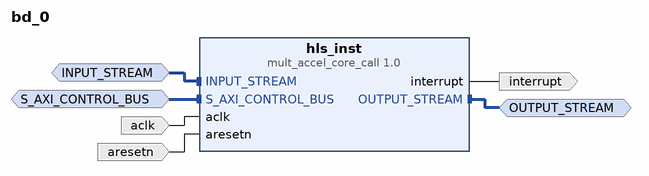
[diagram p0: block diagram of the top level]
# Vivado block design bd_0, xc7z007sclg225-1, Vivado 2018.3
create_bd_design bd_0

create_bd_intf_port -mode Slave -vlnv xilinx.com:interface:axis_rtl:1.0 INPUT_STREAM
set_property -dict [list \
  CONFIG.FREQ_HZ 100000000.0 \
  CONFIG.HAS_TKEEP 1 \
  CONFIG.HAS_TLAST 1 \
  CONFIG.HAS_TREADY 1 \
  CONFIG.HAS_TSTRB 1 \
  CONFIG.LAYERED_METADATA {xilinx.com:interface:datatypes:1.0 {TDATA {datatype {name {attribs {resolve_type immediate dependency {} format string minimum {} maximum {}} value {}} bitwidth {attribs {resolve_type immediate dependency {} format long minimum {} maximum {}} value 32} bitoffset {attribs {resolve_type immediate dependency {} format long minimum {} maximum {}} value 0} integer {signed {attribs {resolve_type immediate dependency {} format bool minimum {} maximum {}} value false}}}} TUSER {datatype {name {attribs {resolve_type immediate dependency {} format string minimum {} maximum {}} value {}} bitwidth {attribs {resolve_type immediate dependency {} format long minimum {} maximum {}} value 4} bitoffset {attribs {resolve_type immediate dependency {} format long minimum {} maximum {}} value 0} integer {signed {attribs {resolve_type immediate dependency {} format bool minimum {} maximum {}} value false}}}}}} \
  CONFIG.TDATA_NUM_BYTES 4 \
  CONFIG.TDEST_WIDTH 5 \
  CONFIG.TID_WIDTH 5 \
  CONFIG.TUSER_WIDTH 4 \
] [get_bd_intf_ports INPUT_STREAM]
create_bd_intf_port -mode Master -vlnv xilinx.com:interface:axis_rtl:1.0 OUTPUT_STREAM
set_property -dict {CONFIG.FREQ_HZ 100000000.0} [get_bd_intf_ports OUTPUT_STREAM]
create_bd_intf_port -mode Slave -vlnv xilinx.com:interface:aximm_rtl:1.0 S_AXI_CONTROL_BUS
set_property -dict [list \
  CONFIG.ADDR_WIDTH 12 \
  CONFIG.ARUSER_WIDTH 0 \
  CONFIG.AWUSER_WIDTH 0 \
  CONFIG.BUSER_WIDTH 0 \
  CONFIG.DATA_WIDTH 32 \
  CONFIG.FREQ_HZ 100000000.0 \
  CONFIG.HAS_BRESP 1 \
  CONFIG.HAS_BURST 0 \
  CONFIG.HAS_CACHE 0 \
  CONFIG.HAS_LOCK 0 \
  CONFIG.HAS_PROT 0 \
  CONFIG.HAS_QOS 0 \
  CONFIG.HAS_REGION 0 \
  CONFIG.HAS_RRESP 1 \
  CONFIG.HAS_WSTRB 1 \
  CONFIG.ID_WIDTH 0 \
  CONFIG.MAX_BURST_LENGTH 1 \
  CONFIG.NUM_READ_OUTSTANDING 1 \
  CONFIG.NUM_READ_THREADS 1 \
  CONFIG.NUM_WRITE_OUTSTANDING 1 \
  CONFIG.NUM_WRITE_THREADS 1 \
  CONFIG.PROTOCOL AXI4LITE \
  CONFIG.READ_WRITE_MODE READ_WRITE \
  CONFIG.RUSER_BITS_PER_BYTE 0 \
  CONFIG.RUSER_WIDTH 0 \
  CONFIG.SUPPORTS_NARROW_BURST 0 \
  CONFIG.WUSER_BITS_PER_BYTE 0 \
  CONFIG.WUSER_WIDTH 0 \
] [get_bd_intf_ports S_AXI_CONTROL_BUS]
create_bd_port -dir I -type clk aclk
set_property -dict {CONFIG.FREQ_HZ 100000000.0} [get_bd_ports aclk]
create_bd_port -dir I -type rst aresetn
create_bd_port -dir O -type intr interrupt

create_bd_cell -type ip -vlnv xilinx.com:hls:mult_accel_core_call:1.0 hls_inst

# ---- connections ----

connect_bd_intf_net -intf_net INPUT_STREAM_0_1 [get_bd_intf_ports INPUT_STREAM] [get_bd_intf_pins hls_inst/INPUT_STREAM]
connect_bd_intf_net [get_bd_intf_ports OUTPUT_STREAM] [get_bd_intf_pins hls_inst/OUTPUT_STREAM]
connect_bd_intf_net -intf_net S_AXI_CONTROL_BUS_0_1 [get_bd_intf_ports S_AXI_CONTROL_BUS] [get_bd_intf_pins hls_inst/S_AXI_CONTROL_BUS]
connect_bd_net -net aclk_0_1 [get_bd_ports aclk] [get_bd_pins hls_inst/aclk]
connect_bd_net -net aresetn_0_1 [get_bd_ports aresetn] [get_bd_pins hls_inst/aresetn]
connect_bd_net [get_bd_pins hls_inst/interrupt] [get_bd_ports interrupt]

# ---- address map ----
assign_bd_address -offset 0x000 -range 4K -target_address_space [get_bd_addr_spaces S_AXI_CONTROL_BUS] [get_bd_addr_segs hls_inst/S_AXI_CONTROL_BUS/Reg]

validate_bd_design
save_bd_design
